# Altium project ece315-F21.PrjPcb (part 2 of 2)

## Sheet 06_CapTouch.SchDoc: ECE315 Analog
size A; Date: 4/25/2017; ApprovedBy: JSK; CheckedBy: JSK; Author: JSK; CompanyName: University of Wisconsin; DrawnBy: JSK; Engineer: JSK; Organization: ECE 315; Address1: College of Engineering; Address2: 1415 Engineering Drive; Address3: Madison, WI 53706; Address4: ECE 315 Fall 2017; Revision: A; SheetNumber: 2; SheetTotal: 2; AssemblyNumber: EMG001; ApprovedDate: 4/25/2017
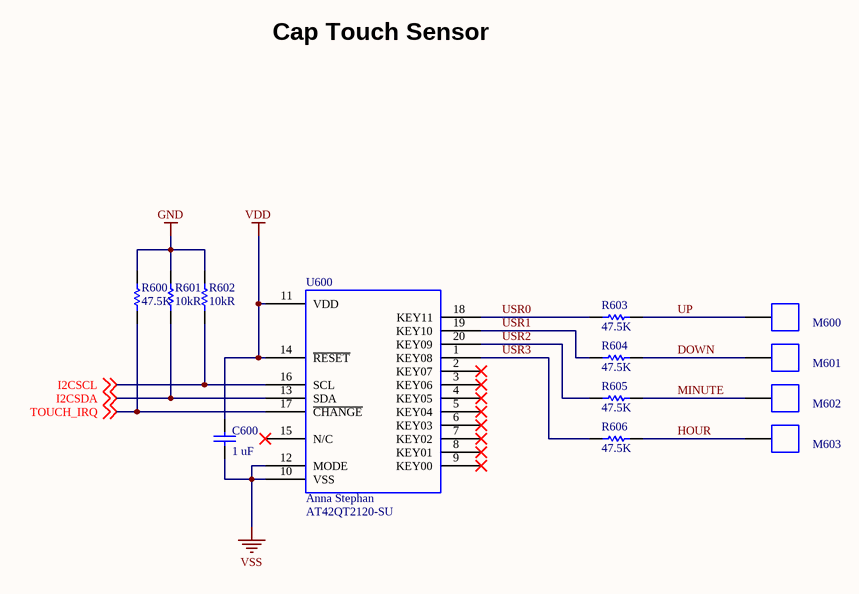
[diagram p5: 06_CapTouch.SchDoc]

### Parts
C600  Capacitance: 1 uF  [CAP_0805]  (hidden comment: CAP_0805_U_001.00)
M600  Mech_TouchPad  [TouchPad]  (value not drawn)  (no BOM)
M601  Mech_TouchPad  [TouchPad]  (value not drawn)  (no BOM)
M602  Mech_TouchPad  [TouchPad]  (value not drawn)  (no BOM)
M603  Mech_TouchPad  [TouchPad]  (value not drawn)  (no BOM)
R600  47.5K  [RES_0805]
R601  Resistance: 10kR  [RES_0805]  (hidden comment: RES_0805_K_010.00)
R602  Resistance: 10kR  [RES_0805]  (hidden comment: RES_0805_K_010.00)
R603  47.5K  [RES_0805]
R604  47.5K  [RES_0805]
R605  47.5K  [RES_0805]
R606  47.5K  [RES_0805]
U600  Drawn_By: Anna Stephan  Manufacturer Part Number 1: AT42QT2120-SU  [AT42QT2120-SOIC]  (hidden comment: IC_AT42QT2120)

### Nets
GND: R600.2 R601.2 R602.2
VDD: C600.1 U600.11(VDD) U600.14(~{RESET})
VSS: C600.2 U600.10(VSS) U600.12(MODE)
DOWN: M601.1 R604.1
HOUR: M603.1 R606.1
I2CSCL: R602.1 U600.16(SCL) ; off-sheet I2CSCL
I2CSDA: R601.1 U600.13(SDA) ; off-sheet I2CSDA
MINUTE: M602.1 R605.1
TOUCH_IRQ: R600.1 U600.17(~{CHANGE}) ; off-sheet TOUCH_IRQ
UP: M600.1 R603.1
USR0: R603.2 U600.18(KEY11)
USR1: R604.2 U600.19(KEY10)
USR2: R605.2 U600.20(KEY09)
USR3: R606.2 U600.1(KEY08)

Not connected (* = marked no-connect by the designer): U600 2(KEY07)* 3(KEY06)* 4(KEY05)* 5(KEY04)* 6(KEY03)* 7(KEY02)* 8(KEY01)* 9(KEY00)* 15(N/C)*

### Notes on the sheet
- Cap Touch Sensor

### Library data of the parts
C600 = CAP_0805_U_001.00: CAP CER 1UF 16V 10% X7R 0805; Manufacturer: Kemet; Manufacturer Part Number: C0805C105K4RACTU; Part # Aliases: C0805C105K4RAC7800; Capacitance - nF: 1000 nF; Case Height: 0.9 mm; Case Length: 2 mm; Case Width: 1.2 mm; Class: Class 1; Dissipation Factor DF: 5; Temperature Coefficient / Code: +/- 15 %; Type: SMD MLCC X7R 6.3 - 250 VDC Commerical Grade; Tolerance: 10 %; Supplier 1: Digikey; Supplier Part Number 1: 399-1284-1-ND; Stock 1: 692931; Pricing 1: 1=0.12, 10=0.087, 100=0.0407, 500=0.0286, 1000=0.0236 (USD); Brand: Kemet; Case Code - in: 0805; Case Code - mm: 2012; Dimensions: 1.2 mm W x 2 mm L x 0.9 mm H; Dielectric: X7R; Lead Spacing: 0.75 mm; Factory Pack Quantity: 2500; Voltage Rating: 16 V; Product Category: Multilayer Ceramic Capacitors MLCC - SMD/SMT; RoHS: Details; Minimum Operating Temperature: - 55 C; Maximum Operating Temperature: + 125 C; Product: General Type MLCCs; Operating Temperature Range: - 55 C to + 125 C; Package / Case: 0805 (2012 metric); Packaging: Reel; Series: C0805C; Termination Style: SMD/SMT; Voltage Rating DC: 16 V; ComponentLink1URL: https://datasheet.ciiva.com/14585/70095383-14585511.pdf; ComponentLink1Description: https://datasheet.ciiva.com/14585/70095383-14585511.pdf; ComponentLink2URL: https://datasheet.ciiva.com/6074/1722731-6074364.pdf; ComponentLink2Description: https://datasheet.ciiva.com/6074/1722731-6074364.pdf; ComponentLink3URL: https://datasheet.ciiva.com/14603/70095383-14603388.pdf; ComponentLink3Description: https://datasheet.ciiva.com/14603/70095383-14603388.pdf; ComponentLink4URL: https://datasheet.ciiva.com/28692/1851736-28692942.pdf; ComponentLink4Description: https://datasheet.ciiva.com/28692/1851736-28692942.pdf; ComponentLink5URL: https://datasheet.ciiva.com/39122/docfinderpartnumberc0402c102k5ractu-39122926.pdf; ComponentLink5Description: https://datasheet.ciiva.com/39122/docfinderpartnumberc0402c102k5ractu-39122926.pdf
M600-M603 = Mech_TouchPad: Capacative Touch Sensor Pad
R600 R603-R606 = RES_0805_K_047.50: Res Thick Film 2.0 x 1.2 mm 47.5K Ohm 1% 0.125W(1/8W) 100ppm/ C Molded SMD Paper T/R; Manufacturer 1: Yageo; Manufacturer Part Number 1: RC0805FR-0747K5L; Power Rating: 125mW; Voltage Rating: 150V; Temperature Coefficient: 100ppm/°C; Supplier 1: Digi-Key; Supplier Part Number 1: 311-47.5KCRCT-ND; RoHS: Yes; Category: Chip SMD Resistors; Stock 1: 246219; Pricing 1: 1=0.10000, 10=0.04200, 100=0.01690, 1000=0.00759, 2500=0.00659 (USD); Mount: Surface Mount; Case/Package: 0805; Case Code (Metric): 2012; Case Code (Imperial): 0805; Size Code: 0805; Min Operating Temperature: -55°C; Max Operating Temperature: 155°C; Tolerance: 1%; Package Quantity: 1; Packaging: Tape and Reel; Resistor Type: Thick Film; Number of Terminations: 2; Termination: SMD/SMT; Max Power Dissipation: 125mW; Voltage Rating (DC): 150V; Features: Moisture Resistant; Series: RC; Technology: THICK FILM; Length: 0.079inch; Width: 0.049inch; Height: 0.024inch; Depth: 1.25mm; Lead Free: Lead Free; RoHS Compliant: Yes; ComponentLink3URL: https://datasheet.ciiva.com/12667/rc0805-12667415.pdf?src-supplier=Mouser; ComponentLink3Description: https://datasheet.ciiva.com/12667/rc0805-12667415.pdf?src-supplier=Mouser; Resistance: 47.5K
R601 R602 = RES_0805_K_010.00: RES SMD 10K OHM 1% 1/8W 0805; Manufacturer 1: Yageo; Manufacturer Part Number 1: RC0805FR-0710KL; Temperature Coefficient: 100ppm/°C; Power Rating: 125mW; Voltage Rating: 150V; Supplier 1: Digi-Key; Supplier Part Number 1: 311-10.0KCRCT-ND; Stock 1: 7562122; Pricing 1: 1=0.10000, 10=0.04200, 100=0.01690, 1000=0.00759, 2500=0.00659 (USD); RoHS: Yes; Case/Package: 0805; Case Code (Imperial): 0805; Case Code (Metric): 2012; Min Operating Temperature: -55°C; Max Operating Temperature: 155°C; Tolerance: 1%; Packaging: Tape and Reel; Features: Moisture Resistant; Termination: SMD/SMT; Number of Terminations: 2; Military Standard: Not; Max Power Dissipation: 125mW; Package Quantity: 1; Length: 2mm; Height: 0.024inch; Width: 0.049inch; Depth: 1.25mm; Lead Free: Lead Free; REACH SVHC: Unknown; ComponentLink1URL: https://datasheet.ciiva.com/11808/0900766b8106beab-11808151.pdf?src-supplier=RSComponents; ComponentLink1Description: https://datasheet.ciiva.com/11808/0900766b8106beab-11808151.pdf?src-supplier=RSComponents; ComponentLink2URL: https://datasheet.ciiva.com/12669/rc0805-12669688.pdf?src-supplier=Mouser; ComponentLink2Description: https://datasheet.ciiva.com/12669/rc0805-12669688.pdf?src-supplier=Mouser; ComponentLink3URL: https://datasheet.ciiva.com/46447/444164-46447563.pdf?src-supplier=Element14; ComponentLink3Description: https://datasheet.ciiva.com/46447/444164-46447563.pdf?src-supplier=Element14; ComponentLink4URL: https://datasheet.ciiva.com/2456/pyu-r-int-thick-7-2456972.pdf?src-supplier=Digi-Key; ComponentLink4Description: https://datasheet.ciiva.com/2456/pyu-r-int-thick-7-2456972.pdf?src-supplier=Digi-Key; ComponentLink5URL: https://datasheet.ciiva.com/2456/pyu-r-int-thick-7-2456973.pdf?src-supplier=Digi-Key; ComponentLink5Description: https://datasheet.ciiva.com/2456/pyu-r-int-thick-7-2456973.pdf?src-supplier=Digi-Key; ComponentLink6URL: https://datasheet.ciiva.com/2456/pyu-r-int-thick-7-2456974.pdf?src-supplier=Digi-Key; ComponentLink6Description: https://datasheet.ciiva.com/2456/pyu-r-int-thick-7-2456974.pdf?src-supplier=Digi-Key; ComponentLink7URL: https://datasheet.ciiva.com/16747/rc0805-16747087.pdf?src-supplier=Future+Electronics; ComponentLink7Description: https://datasheet.ciiva.com/16747/rc0805-16747087.pdf?src-supplier=Future+Electronics; Category: Chip SMD Resistors; Size Code: 0805; Resistor Type: Thick Film; Series: RC; Construction: Rectangular; Resistance Tolerance: 1%; Technology: THICK FILM; RoHS Compliant: Yes
U600 = AT42QT2120: IC TOUCH SENSOR 12CH 20SOIC; Manufacturer 1: Microchip / Atmel; Interface: I2C; ComponentLink1URL: http://www.atmel.com/images/doc9634.pdf; ComponentLink1Description: http://www.atmel.com/images/doc9634.pdf; Supplier 1: Digi-Key; Supplier Part Number 1: AT42QT2120-SU-ND; RoHS: Yes; Category: Uncategorized; Stock 1: 417; Pricing 1: 1=1.31000, 25=1.21000, 100=1.09200 (USD); Case/Package: SOIC; Min Operating Temperature: -40°C; Max Operating Temperature: 85°C; Packaging: Rail/Tube; Package Quantity: 37; Series: QTouch™; RoHS Compliant: Yes; ComponentLink2URL: https://datasheet.ciiva.com/6483/doc9634-6483479.pdf?src-supplier=Digi-Key; ComponentLink2Description: https://datasheet.ciiva.com/6483/doc9634-6483479.pdf?src-supplier=Digi-Key; ComponentLink3URL: https://datasheet.ciiva.com/12177/doc9634-271534-12177086.pdf?src-supplier=Mouser; ComponentLink3Description: https://datasheet.ciiva.com/12177/doc9634-271534-12177086.pdf?src-supplier=Mouser

## Sheet 07_Buzzer.SchDoc: ECE315 Analog
size A; Date: 4/25/2017; ApprovedBy: JSK; CheckedBy: JSK; Author: JSK; CompanyName: University of Wisconsin; DrawnBy: JSK; Engineer: JSK; Organization: ECE 315; Address1: College of Engineering; Address2: 1415 Engineering Drive; Address3: Madison, WI 53706; Address4: ECE 315 Fall 2017; Revision: A; SheetNumber: 2; SheetTotal: 2; AssemblyNumber: ECE315-F19; ApprovedDate: 04/02/2019
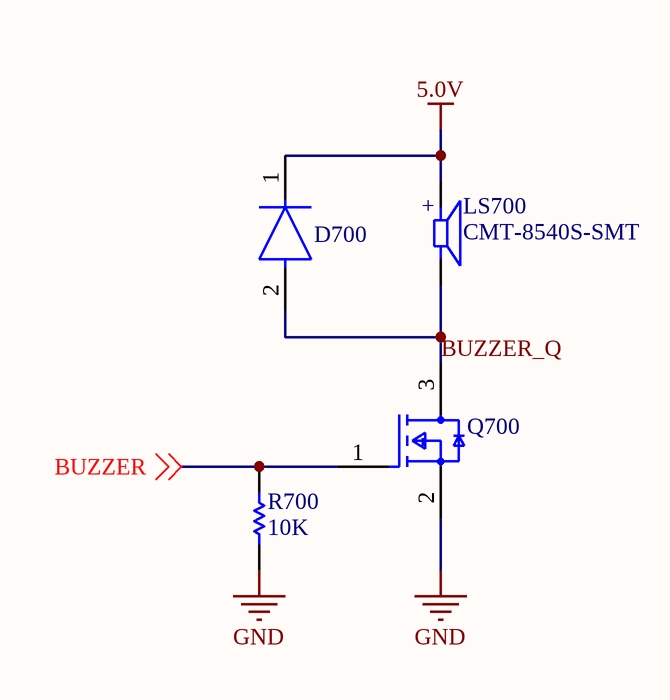
[diagram p6: 07_Buzzer.SchDoc]

### Parts
D700  CGRM4004-G  [Diodes_SOD123_IPC_A]  (value not drawn)
LS700  CMT-8540S-SMT  [CUI_CMT-8540S-SMT]
Q700  DMN6140L-13  [Diodes_Inc_SOT23_IPC_A]  (value not drawn)
R700  Resistance: 10K  [RES_0805]  (hidden comment: RES_0805_K_010.00)

### Nets
5.0V: D700.1(C) LS700.P
GND: Q700.2(S) R700.1
BUZZER: Q700.1(G) R700.2 ; off-sheet BUZZER
BUZZER_Q: D700.2(A) LS700.N Q700.3(D)

### Notes on the sheet
- (in symbol CMT-8540S-SMT) +

### Library data of the parts
D700 = CGRM4004-G: DIODE GEN PURP 400V 1A MINISMA; Manufacturer 1: Comchip; Max Surge Current: 30A; Max Reverse Current: 5uA; Supplier 1: Digi-Key; Supplier Part Number 1: 641-1329-1-ND; Manufacturer Part Number 1: CGRM4004-G; RoHS: Yes; Category: Rectifier Diodes; Stock 1: 345536; Pricing 1: 1=0.41000, 10=0.30400, 100=0.17190, 500=0.11384, 1000=0.08728 (USD); Mount: Surface Mount; Package Quantity: 1; Packaging: Tape and Reel; Average Rectified Current: 1A; Reverse Voltage: 400V; Max Reverse Voltage (DC): 400V; RoHS Compliant: Yes; ComponentLink1URL: https://datasheet.ciiva.com/912/cgrm4001-gthru-cgrm4007-grevd-912412.pdf?src-supplier=Digi-Key; ComponentLink1Description: https://datasheet.ciiva.com/912/cgrm4001-gthru-cgrm4007-grevd-912412.pdf?src-supplier=Digi-Key; ComponentLink2URL: https://datasheet.ciiva.com/912/cgrm4001-gthru-cgrm4007-grevd-912413.pdf?src-supplier=Digi-Key; ComponentLink2Description: https://datasheet.ciiva.com/912/cgrm4001-gthru-cgrm4007-grevd-912413.pdf?src-supplier=Digi-Key; ComponentLink3URL: https://datasheet.ciiva.com/912/cgrm4001-gthru-cgrm4007-grevd-912414.pdf?src-supplier=Digi-Key; ComponentLink3Description: https://datasheet.ciiva.com/912/cgrm4001-gthru-cgrm4007-grevd-912414.pdf?src-supplier=Digi-Key
LS700 = CMT-8540S-SMT: AUDIO MAGNETIC XDCR 1-6V SMD; Manufacturer 1: CUI; MF: CUI Devices; MP: CMT-8540S-SMT-TR; Voltage Rating: 5V; Frequency: 4kHz; Operating Supply Current: 150mA; CUI_purchase_URL: https://www.cuidevices.com/product/audio/buzzers/audio-transducers/cmt-8540s-smt-tr?utm_source=snapeda.com&utm_medium=referral&utm_campaign=snapedaBOM; SnapEDA_Link: https://www.snapeda.com/parts/CMT-8540S-SMT-TR/CUI%20Devices/view-part/587791/?ref=snap; Availability: Unavailable; Package: CUI Inc.; Value: *; Price: None; Supplier 1: Digi-Key; Supplier Part Number 1: 102-3746-1-ND; Manufacturer Part Number 1: CMT-8540S-SMT-TR; RoHS: Yes; Category: Audio Products; Stock 1: 66147; Pricing 1: 1=3.23000, 10=2.67000, 25=2.46400, 50=2.31400, 100=2.16990, 500=1.91520 (USD); Min Operating Temperature: -20°C; Max Operating Temperature: 70°C; Sensing Method: Magnetic; Lead Free: Lead Free; ComponentLink1URL: https://www.cui.com/product/resource/digikeypdf/cmt-8540s-smt.pdf?src-supplier=Digi-Key; ComponentLink1Description: https://www.cui.com/product/resource/digikeypdf/cmt-8540s-smt.pdf?src-supplier=Digi-Key
Q700 = DMN6140L-13: MOSFET N-CH 60V 300MA SOT23-3; Manufacturer 1: Diodes; Manufacturer Part Number 1: 2N7002K-7; Nominal Vgs: 1.6V; Rds On Max: 2R; Input Capacitance: 50pF; Rise Time: 3.4ns; Number of Elements: 1; Max Power Dissipation: 540mW; Continuous Drain Current (ID): 380mA; Drain to Source Resistance: 3R; Gate to Source Voltage (Vgs): 20V; Fall Time: 9.9ns; Turn-Off Delay Time: 15.7ns; Turn-On Delay Time: 3.9ns; Element Configuration: Single; Polarity: N-CHANNEL; ComponentLink1URL: https://datasheet.ciiva.com/29746/dmn6140l-29746783.pdf?src-supplier=Digi-Key; ComponentLink1Description: https://datasheet.ciiva.com/29746/dmn6140l-29746783.pdf?src-supplier=Digi-Key; Supplier 1: Digi-Key; Supplier Part Number 1: 2N7002K-7DICT-ND; RoHS: Yes; Category: MOSFETs; Stock 1: 643550; Pricing 1: 1=0.22000, 10=0.18300, 25=0.15360, 100=0.09720, 500=0.06394, 1000=0.04348 (USD); Mount: Surface Mount; Case/Package: SOT-23; Number of Pins: 3; Weight: 0.000282oz; Min Operating Temperature: -55°C; Max Operating Temperature: 150°C; Package Quantity: 3000; Packaging: Tape and Reel; Drain to Source Voltage (Vdss): 60V; Number of Channels: 1; Drain to Source Breakdown Voltage: 60V; Threshold Voltage: 1.6V; Power Dissipation: 540mW; On-State Resistance: 2R; Series: -; Drain-source On Resistance-Max: 2R; Length: 2.9mm; Width: 1.3mm; Height: 1mm; Radiation Hardening: No; REACH SVHC: No SVHC; Lead Free: Lead Free; RoHS Compliant: Yes; ComponentLink2URL: https://datasheet.ciiva.com/4444/ds30896-81375-4444887.pdf?src-supplier=Mouser; ComponentLink2Description: https://datasheet.ciiva.com/4444/ds30896-81375-4444887.pdf?src-supplier=Mouser; ComponentLink3URL: https://datasheet.ciiva.com/1254/ds30896-1254496.pdf?src-supplier=Newark; ComponentLink3Description: https://datasheet.ciiva.com/1254/ds30896-1254496.pdf?src-supplier=Newark; ComponentLink4URL: https://datasheet.ciiva.com/25624/0900766b81151e8c-25624936.pdf?src-supplier=RSComponents; ComponentLink4Description: https://datasheet.ciiva.com/25624/0900766b81151e8c-25624936.pdf?src-supplier=RSComponents; ComponentLink5URL: https://datasheet.ciiva.com/15137/getdatasheetpartid-75159-15137378.pdf?src-supplier=Verical; ComponentLink5Description: https://datasheet.ciiva.com/15137/getdatasheetpartid-75159-15137378.pdf?src-supplier=Verical; ComponentLink6URL: https://datasheet.ciiva.com/48532/ds30896-48532645.pdf?src-supplier=Avnet; ComponentLink6Description: https://datasheet.ciiva.com/48532/ds30896-48532645.pdf?src-supplier=Avnet; ComponentLink7URL: https://datasheet.ciiva.com/1188/ds30896-1188422.pdf?src-supplier=Element14; ComponentLink7Description: https://datasheet.ciiva.com/1188/ds30896-1188422.pdf?src-supplier=Element14; ComponentLink8URL: https://datasheet.ciiva.com/16200/ds30896-16200842.pdf?src-supplier=Future+Electronics; ComponentLink8Description: https://datasheet.ciiva.com/16200/ds30896-16200842.pdf?src-supplier=Future+Electronics; ComponentLink9URL: https://datasheet.ciiva.com/17323/ds30896-17323945.pdf?src-supplier=Avnet+Europe; ComponentLink9Description: https://datasheet.ciiva.com/17323/ds30896-17323945.pdf?src-supplier=Avnet+Europe
R700 = RES_0805_K_010.00: RES 10K 1/10W 1% 0805 SMD; Manufacturer 1: Yageo; Manufacturer Part Number 1: RC0805FR-0710KL; Temperature Coefficient: 100ppm/°C; Power Rating: 125mW; Voltage Rating: 150V; Supplier 1: Digi-Key; Supplier Part Number 1: 311-10.0KCRDKR-ND; Stock 1: 23045964; Pricing 1: 1=0.10000, 10=0.04000, 100=0.01630, 1000=0.00731, 2500=0.00635 (USD); RoHS: Yes; Case/Package: 0805; Case Code (Imperial): 0805; Case Code (Metric): 2012; Min Operating Temperature: -55°C; Max Operating Temperature: 155°C; Composition: Thick Film; Tolerance: 1%; Packaging: Tape and Reel; Features: Moisture Resistant; Termination: SMD/SMT; Number of Terminations: 2; Military Standard: Not; Max Power Dissipation: 125mW; Package Quantity: 1; Length: 2mm; Height: 0.024inch; Width: 0.049inch; Depth: 1.25mm; Lead Free: Lead Free; REACH SVHC: Unknown; ComponentLink1URL: https://datasheet.ciiva.com/11808/0900766b8106beab-11808151.pdf?src-supplier=RSComponents; ComponentLink1Description: https://datasheet.ciiva.com/11808/0900766b8106beab-11808151.pdf?src-supplier=RSComponents; ComponentLink2URL: https://datasheet.ciiva.com/12669/rc0805-12669688.pdf?src-supplier=Mouser; ComponentLink2Description: https://datasheet.ciiva.com/12669/rc0805-12669688.pdf?src-supplier=Mouser; ComponentLink3URL: https://datasheet.ciiva.com/46447/444164-46447563.pdf?src-supplier=Element14; ComponentLink3Description: https://datasheet.ciiva.com/46447/444164-46447563.pdf?src-supplier=Element14; ComponentLink4URL: https://datasheet.ciiva.com/2456/pyu-r-int-thick-7-2456972.pdf?src-supplier=Digi-Key; ComponentLink4Description: https://datasheet.ciiva.com/2456/pyu-r-int-thick-7-2456972.pdf?src-supplier=Digi-Key; ComponentLink5URL: https://datasheet.ciiva.com/2456/pyu-r-int-thick-7-2456973.pdf?src-supplier=Digi-Key; ComponentLink5Description: https://datasheet.ciiva.com/2456/pyu-r-int-thick-7-2456973.pdf?src-supplier=Digi-Key; ComponentLink6URL: https://datasheet.ciiva.com/2456/pyu-r-int-thick-7-2456974.pdf?src-supplier=Digi-Key; ComponentLink6Description: https://datasheet.ciiva.com/2456/pyu-r-int-thick-7-2456974.pdf?src-supplier=Digi-Key; ComponentLink7URL: https://datasheet.ciiva.com/16747/rc0805-16747087.pdf?src-supplier=Future+Electronics; ComponentLink7Description: https://datasheet.ciiva.com/16747/rc0805-16747087.pdf?src-supplier=Future+Electronics

## Sheet 08_Mechanicals.SchDoc
size A; ApprovedDate: 04/02/2019; AssemblyNumber: ECE315-F19
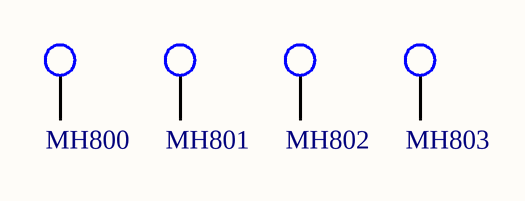
[diagram p7: 08_Mechanicals.SchDoc]

### Parts
MH800  MHOLE_2_55MM  [MHOLE_2_55MM]  (value not drawn)  (no BOM)
MH801  MHOLE_2_55MM  [MHOLE_2_55MM]  (value not drawn)  (no BOM)
MH802  MHOLE_2_55MM  [MHOLE_2_55MM]  (value not drawn)  (no BOM)
MH803  MHOLE_2_55MM  [MHOLE_2_55MM]  (value not drawn)  (no BOM)

### Nets

Not connected (* = marked no-connect by the designer): MH800 1; MH801 1; MH802 1; MH803 1

### Library data of the parts
MH800-MH803 = MHOLE_2_55MM: Mounting Holde; Manufacturer Part Number: UW MTHOLE

## Nets that join several sheets
3.3V: 03_MCU (P300.1), 04_Seven_Seg (8 pins)
5.0V: 02-Power (5 pins), 03_MCU (P300.2), 07_Buzzer (D700.1 LS700.P)
GND: 02-Power (7 pins), 03_MCU (P300.4 P301.2), 05_Seven_Seg (16 pins), 06_CapTouch (R600.2 R601.2 R602.2), 07_Buzzer (Q700.2 R700.1)
BUZZER: 03_MCU (P301.7), 07_Buzzer (Q700.1 R700.2)
DIG0_N: 03_MCU (P301.19), 04_Seven_Seg (Q403.1 R403.1)
DIG1_N: 03_MCU (P301.17), 04_Seven_Seg (Q402.1 R402.1)
DIG2_N: 03_MCU (P301.15), 04_Seven_Seg (Q401.1 R401.1)
DIG3_N: 03_MCU (P301.13), 04_Seven_Seg (Q400.1 R400.1)
I2CSCL: 03_MCU (P300.17), 06_CapTouch (R602.1 U600.16)
I2CSDA: 03_MCU (P300.19), 06_CapTouch (R601.1 U600.13)
SEG_A: 04_Seven_Seg (DS400.7 DS401.7 DS402.7 DS403.7), 05_Seven_Seg (R500.2)
SEG_B: 04_Seven_Seg (DS400.6 DS401.6 DS402.6 DS403.6), 05_Seven_Seg (R501.2)
SEG_C: 04_Seven_Seg (DS400.4 DS401.4 DS402.4 DS403.4), 05_Seven_Seg (R502.2)
SEG_D: 04_Seven_Seg (DS400.2 DS401.2 DS402.2 DS403.2), 05_Seven_Seg (R503.2)
SEG_DP: 04_Seven_Seg (DS403.5), 05_Seven_Seg (R513.2)
SEG_E: 04_Seven_Seg (DS400.1 DS401.1 DS402.1 DS403.1), 05_Seven_Seg (R504.2)
SEG_EN_A: 03_MCU (P301.9), 05_Seven_Seg (Q500.1 R506.2)
SEG_EN_B: 03_MCU (P301.5), 05_Seven_Seg (Q501.1 R507.2)
SEG_EN_C: 03_MCU (P301.3), 05_Seven_Seg (Q502.1 R508.2)
SEG_EN_D: 03_MCU (P301.4), 05_Seven_Seg (Q503.1 R509.2)
SEG_EN_DP: 03_MCU (P300.9), 05_Seven_Seg (Q507.1 R515.2)
SEG_EN_E: 03_MCU (P300.11), 05_Seven_Seg (Q504.1 R510.2)
SEG_EN_F: 03_MCU (P300.13), 05_Seven_Seg (Q505.1 R511.2)
SEG_EN_G: 03_MCU (P300.15), 05_Seven_Seg (Q506.1 R514.2)
SEG_F: 04_Seven_Seg (DS400.9 DS401.9 DS402.9 DS403.9), 05_Seven_Seg (R505.2)
SEG_G: 04_Seven_Seg (DS400.10 DS401.10 DS402.10 DS403.10), 05_Seven_Seg (R512.2)
TOUCH_IRQ: 03_MCU (P300.20), 06_CapTouch (R600.1 U600.17)